# EAGLE schematic minimumduino-uno (EAGLE 8.6.3)
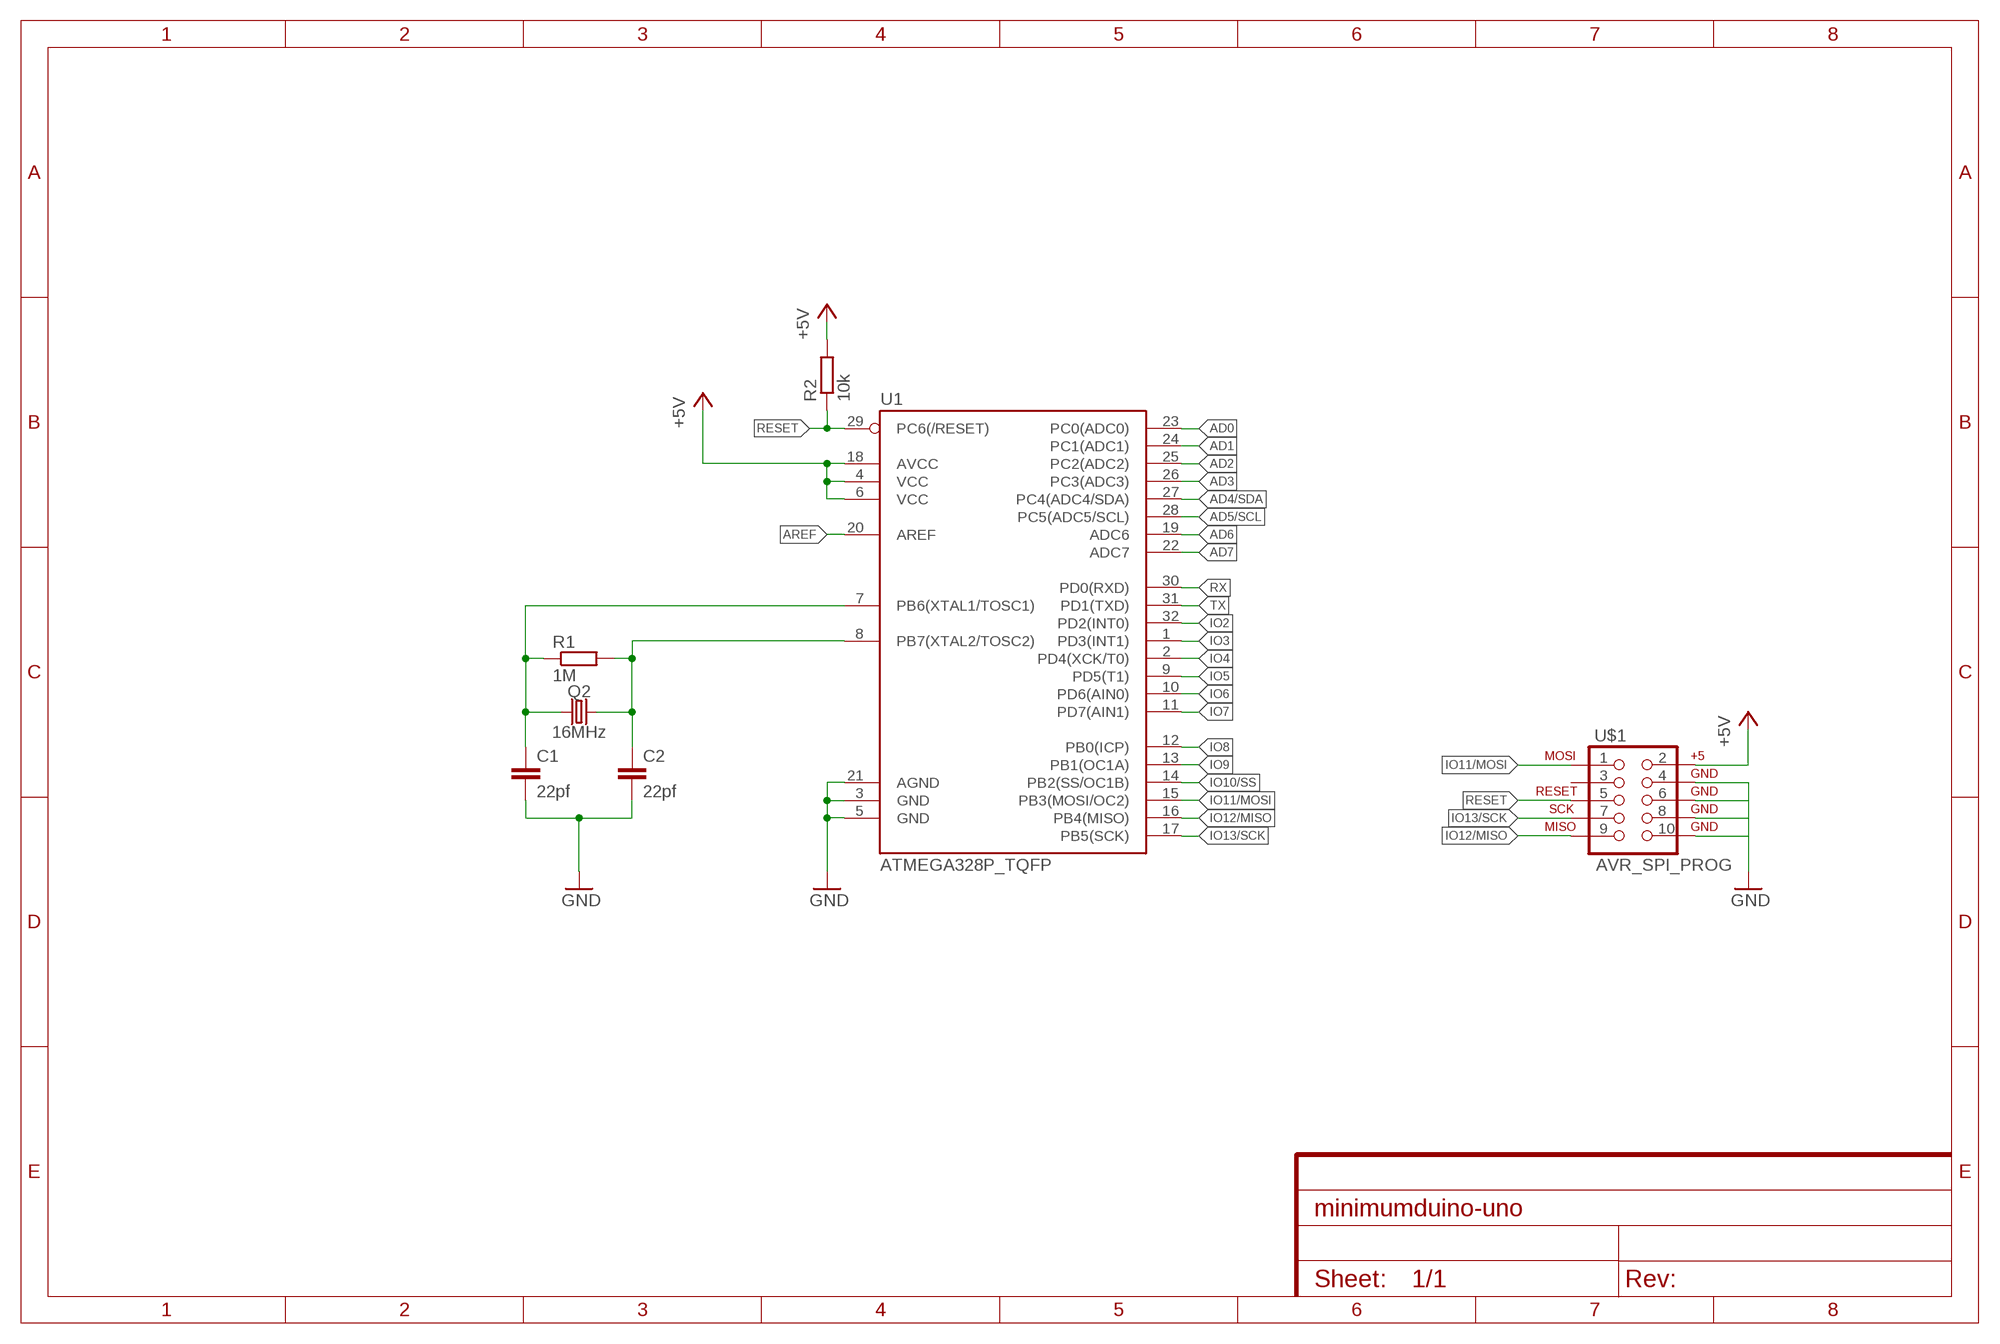
[diagram p0: schematic, sheet 1]

## Parts
C1  22pf  C-EUC1206  [C1206]
C2  22pf  C-EUC1206  [C1206]
Q2  16MHz  CRYSTALPTH-HC49UV  [HC49U]
R1  1M  R-EU_R1206  [R1206]
R2  10k  R-EU_R1206  [R1206]
U1  ATMEGA328P_TQFP  [TQFP32-08]
U$1  AVR_SPI_PROG  [AVR_ICSP]

## Nets
328_OSC1: C1.1 Q2.1 R1.1 U1.7(PB6(XTAL1/TOSC1))
328_OSC2: C2.1 Q2.2 R1.2 U1.8(PB7(XTAL2/TOSC2))
+5V [power usb]: R2.2 U1.4(VCC) U1.6(VCC) U1.18(AVCC) U$1.2
AD0: U1.23(PC0(ADC0))
AD1: U1.24(PC1(ADC1))
AD2: U1.25(PC2(ADC2))
AD3: U1.26(PC3(ADC3))
AD4/SDA: U1.27(PC4(ADC4/SDA))
AD5/SCL: U1.28(PC5(ADC5/SCL))
AD6: U1.19(ADC6)
AD7: U1.22(ADC7)
AREF: U1.20(AREF)
GND [gnd]: C1.2 C2.2 U1.3(GND) U1.5(GND) U1.21(AGND) U$1.4 U$1.6 U$1.8 U$1.10
IO2: U1.32(PD2(INT0))
IO3: U1.1(PD3(INT1))
IO4: U1.2(PD4(XCK/T0))
IO5: U1.9(PD5(T1))
IO6: U1.10(PD6(AIN0))
IO7: U1.11(PD7(AIN1))
IO8: U1.12(PB0(ICP))
IO9: U1.13(PB1(OC1A))
IO10/SS: U1.14(PB2(SS/OC1B))
IO11/MOSI: U1.15(PB3(MOSI/OC2)) U$1.1
IO12/MISO: U1.16(PB4(MISO)) U$1.9
IO13/SCK: U1.17(PB5(SCK)) U$1.7
RESET: R2.1 U1.29(PC6(/RESET)) U$1.5
RX: U1.30(PD0(RXD))
TX: U1.31(PD1(TXD))
Unconnected: U$1.3

## Library data of the parts
C1 C2 = rcl:C-EU: CAPACITOR, European symbol; SPICEPREFIX: C
Q2 = SparkFun-Clocks:CRYSTAL: Crystals (Generic) These are passive quartz crystals, which can be used as a clock source for a microcontroller. Crystal's are two-terminal devices. They require external "load" capacitors to generate an oscillating signal.
R1 R2 = rcl:R-EU_: RESISTOR, European symbol; SPICEPREFIX: R
U1 = SparkFun-IC-Microcontroller:ATMEGA328P_TQFP: Popular 328P in QFP Storefront component: ATmega328 - TQFP <https://www.sparkfun.com/products/13448> (COM-13448) Datasheet <http://www.sparkfun.com/datasheets/Components/SMD/ATMega328.pdf> SparkFun Products SparkFun RedBoard - Programmed with Arduino <https://www.sparkfun.com/products/12757> (DEV-12757) Arduino Pro Mini 328 - 5V/16MHz <https://www.sparkfun.com/products/11113> (DEV-11113) Arduino Pro Mini 328 - 3.3V/8MHz <https://www.sparkfun.com/products/11114> (DEV-11114) SparkFun OpenLog <https://www.sparkfun.com/products/13712> (DEV-13712) SparkFun MicroView - OLED Arduino Module <https://www.sparkfun.com/products/12923> (DEV-12923) SparkFun Digital Sandbox <https://www.sparkfun.com/products/12651> (DEV-12651) SparkFun PicoBoard <https://www.sparkfun.com/products/11888> (WIG-11888) Arduino Fio <https://www.sparkfun.com/products/10116> (DEV-10116) LilyPad Arduino 328 Main Board <https://www.sparkfun.com/products/13342> (DEV-13342) SparkFun RedStick <https://www.sparkfun.com/products/13741> (DEV-13741) LilyPad MP3 <https://www.sparkfun.com/products/11013> (DEV-11013) LilyPad Arduino SimpleSnap <https://www.sparkfun.com/products/10941> (DEV-10941) SparkFun Stepoko <https://www.sparkfun.com/products/13899> (ROB-13899) SparkFun Geiger Counter <https://www.sparkfun.com/products/11345> (SEN-11345) SparkFun EL Sequencer <https://www.sparkfun.com/products/12781> (COM-12781) Arduino Pro 328 - 5V/16MHz <https://www.sparkfun.com/products/10915> (DEV-10915) CryptoCape <https://www.sparkfun.com/products/12773> (DEV-12773) SparkFun IR Thermometer Evaluation Board - MLX90614 <https://www.sparkfun.com/products/10740> (SEN-10740) SparkFun RedBot Mainboard <https://www.sparkfun.com/products/12097> (ROB-12097) Arduino Pro 328 - 3.3V/8MHz <https://www.sparkfun.com/products/10914> (DEV-10914) SparkFun Block for Intel® Edison - Arduino <https://www.sparkfun.com/products/13036> (DEV-13036) SparkFun Simon Says - Surface Mount Soldering Kit <https://www.sparkfun.com/products/10935> (KIT-10935) SparkFun 7-Segment Serial Display - Red <https://www.sparkfun.com/products/11441> (COM-11441) SparkFun 7-Segment Serial Display - White <https://www.sparkfun.com/products/11629> (COM-11629) SparkFun 7-Segment Serial Display - Yellow <https://www.sparkfun.com/products/11443> (COM-11443) SparkFun 7-Segment Serial Display - Kelly Green <https://www.sparkfun.com/products/11440> (COM-11440) SparkFun 7-Segment Serial Display - Blue <https://www.sparkfun.com/products/11442> (COM-11442) SparkFun OpenSegment Serial Display - 20mm (Blue) <https://www.sparkfun.com/products/11647> (COM-11647) SparkFun OpenSegment Serial Display - 20mm (Green) <https://www.sparkfun.com/products/11646> (COM-11646) SparkFun OpenSegment Serial Display - 20mm (White) <https://www.sparkfun.com/products/11648> (COM-11648) SparkFun OpenSegment Serial Display - 20mm (Red) <https://www.sparkfun.com/products/11644> (COM-11644) SparkFun OpenSegment Serial Display - 20mm (Yellow) <https://www.sparkfun.com/products/11645> (COM-11645) SparkFun OpenSegment Shield <https://www.sparkfun.com/products/13190> (DEV-13190); PROD_ID: IC-09069
U$1 = SparkFun:AVR_SPI_PROG: AVR ICSP Header This is the standard AVR In Circuit Serial Programming header. Minimal, but includes pin one indicator. Works with standard Olimex programmers. Also look for the 6-pin reduced version. Spark Fun Electronics SKU: PRT-00778

## Net classes
2 gnd: width 0.305 mm, drill 0.406 mm, clearance 0.203 mm
3 power usb: width 0.508 mm, drill 0.406 mm, clearance 0.203 mm